# EasyEDA Pro project ProPrj_SRC_Robot2025_V1.0_2026-09-06.epro, schematic Schematic-CTRL

## Sheets
1 P1: Board Name: Ctrl_Board; Create Date: 2025-07-09; Page Name: P1; Project Name: SRC_Robot2025_V1.0; Schematic Name: Schematic-CTRL; Update Date: 2025-08-07; Company: 嘉立创EDA; Page Size: A4; Version: V1.0
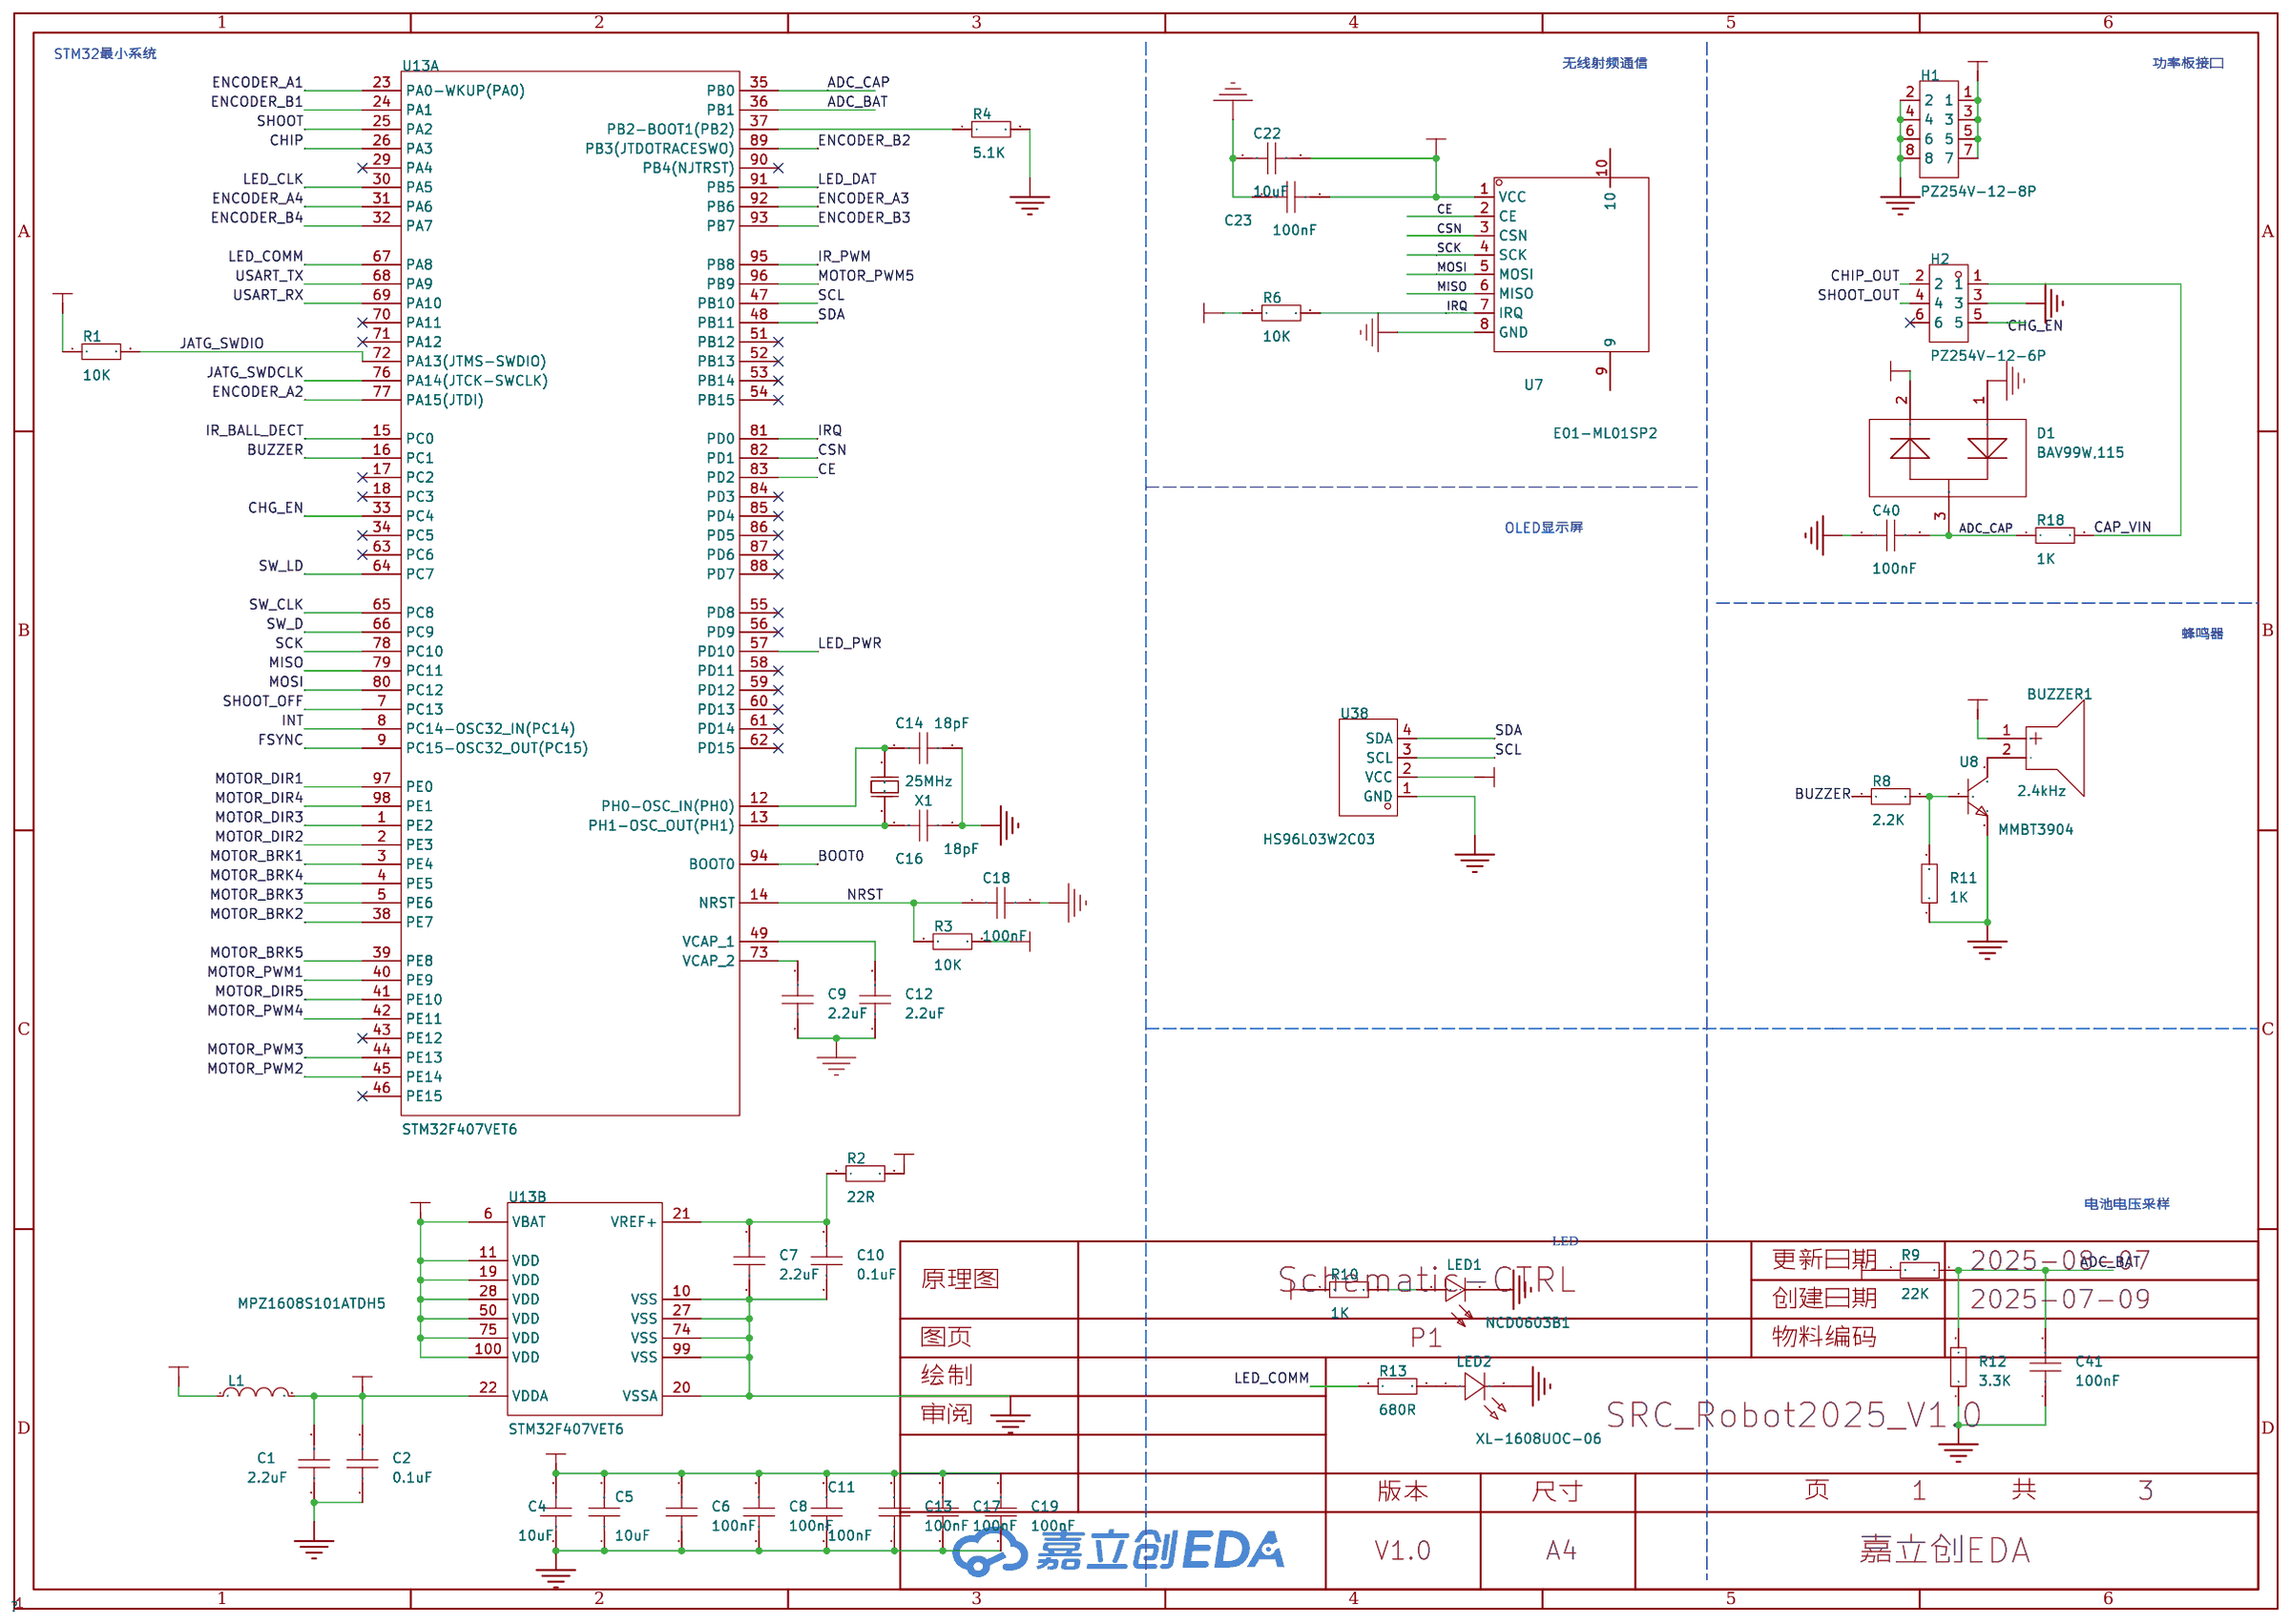
[diagram p0: P1]
2 P2: Page Name: P2
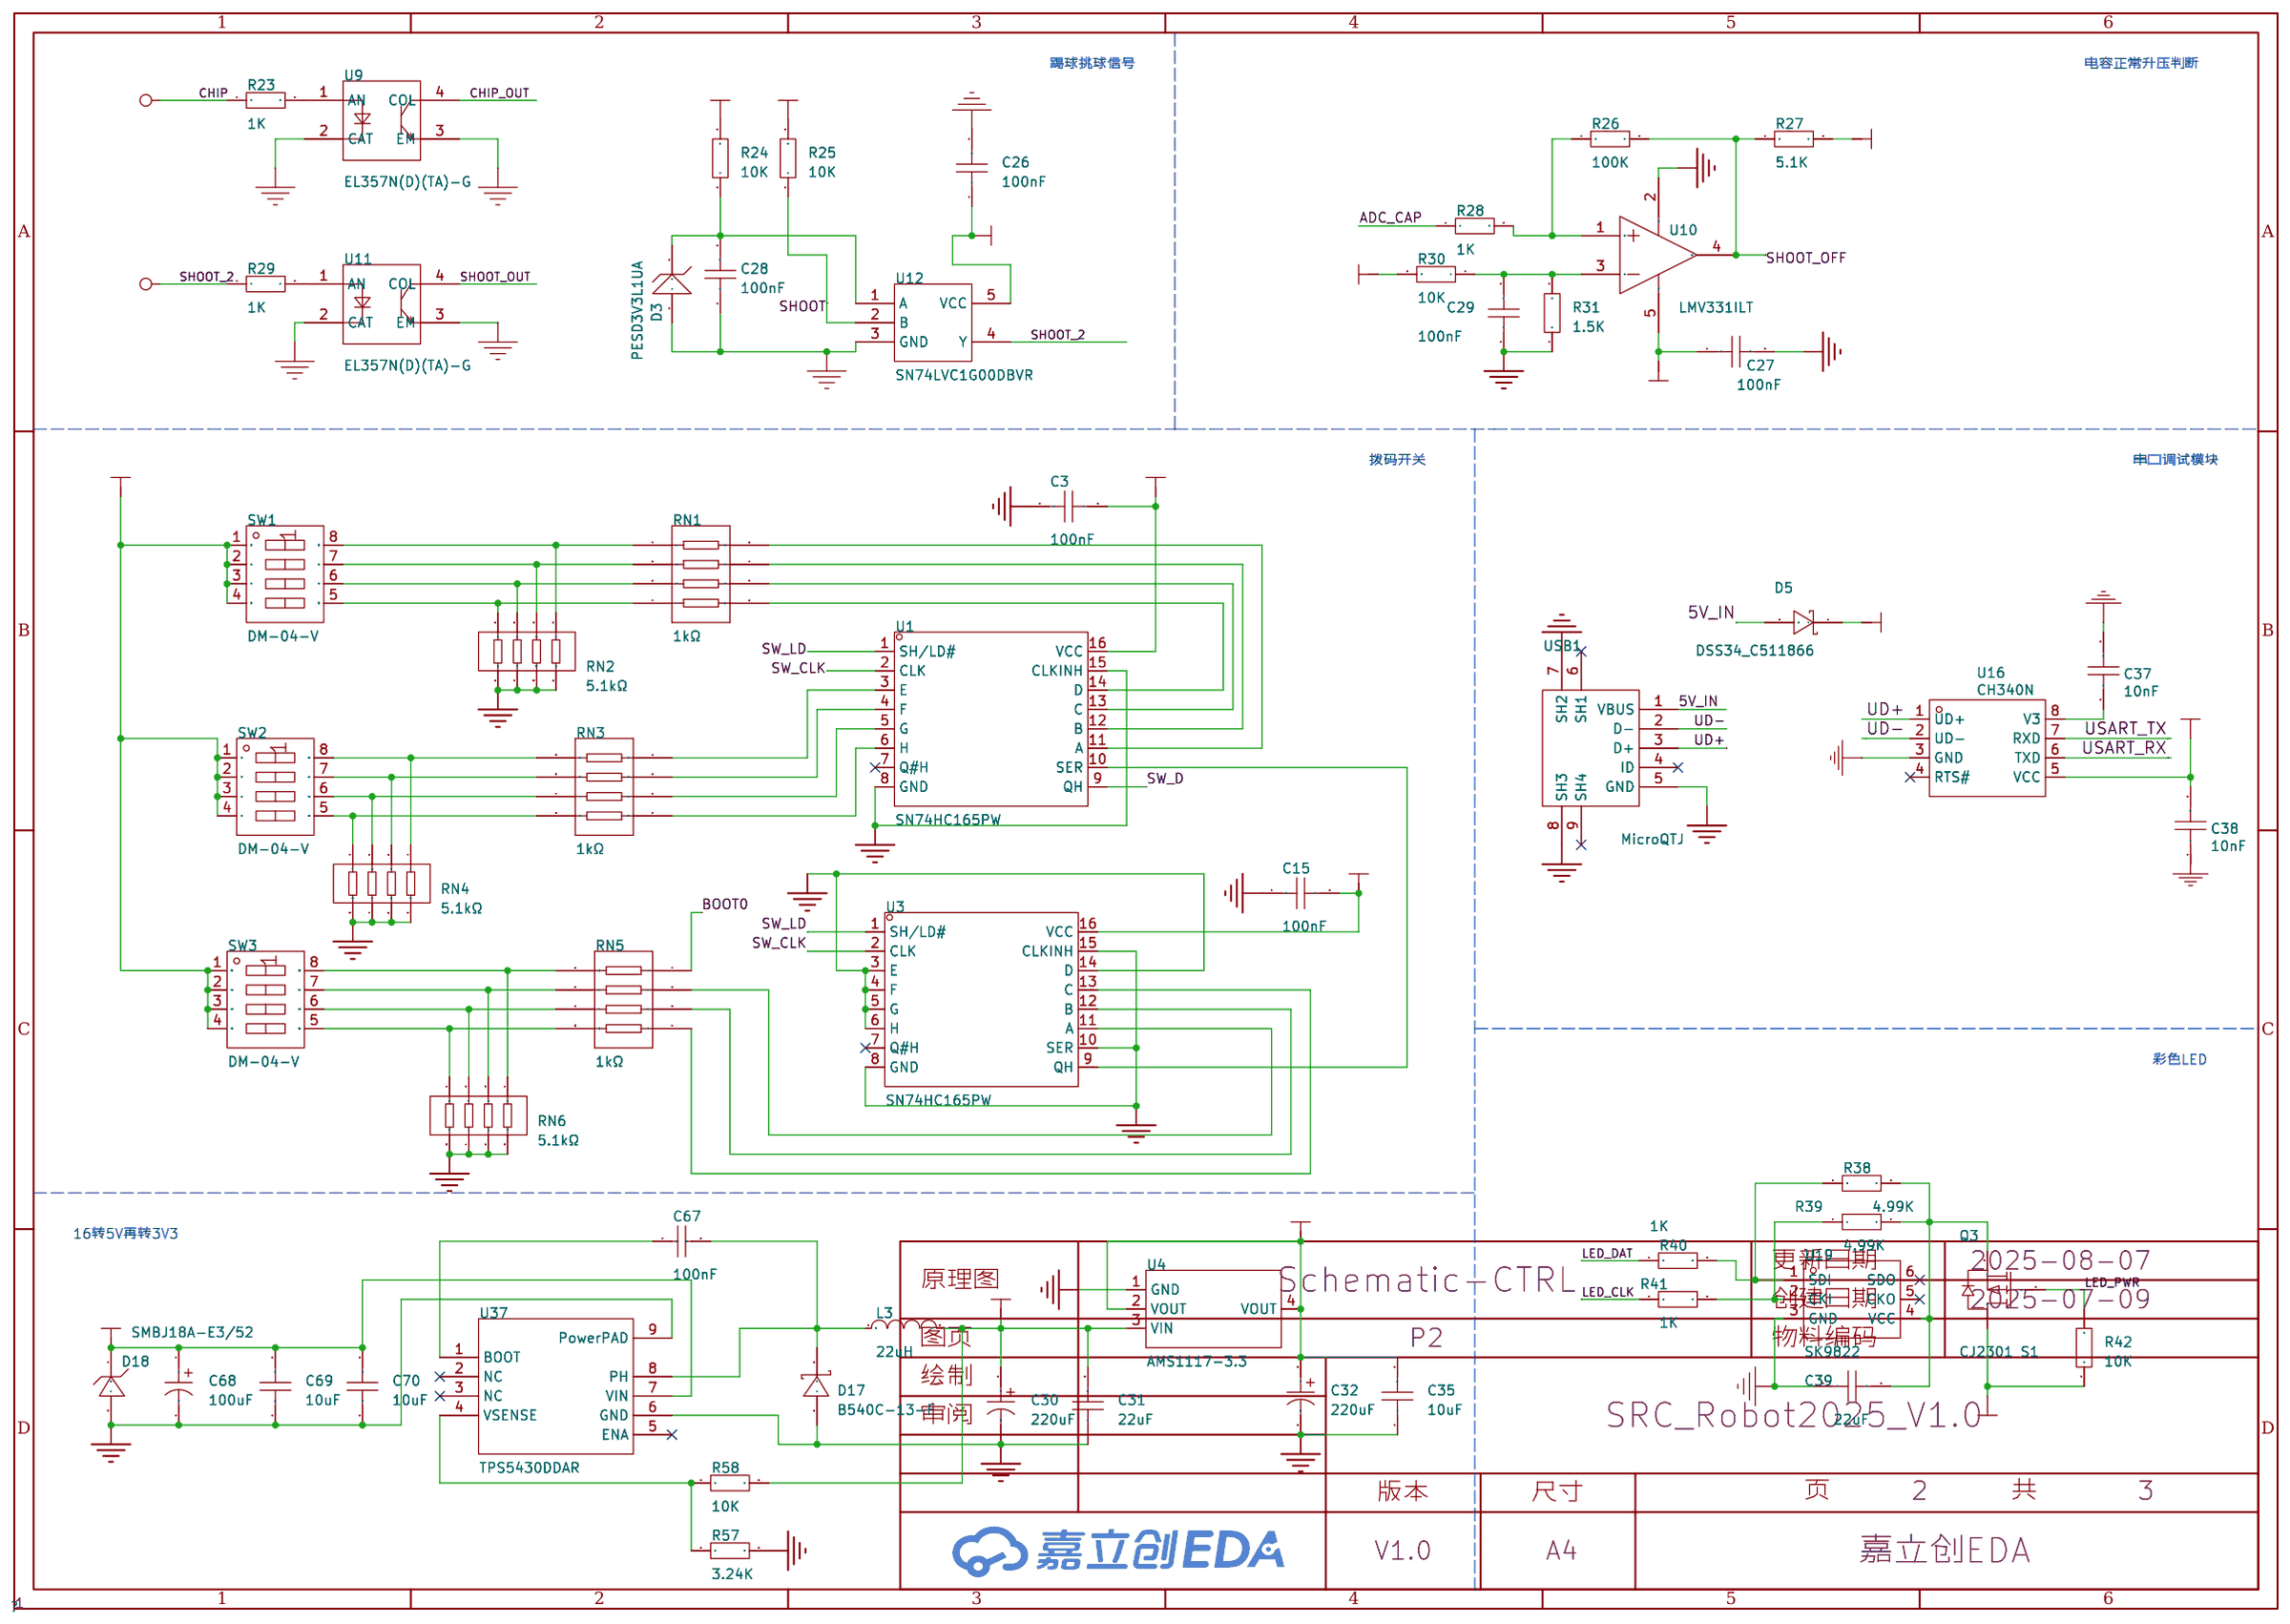
[diagram p1: P2]
3 P3: Page Name: P3; Update Date: 2026-03-02
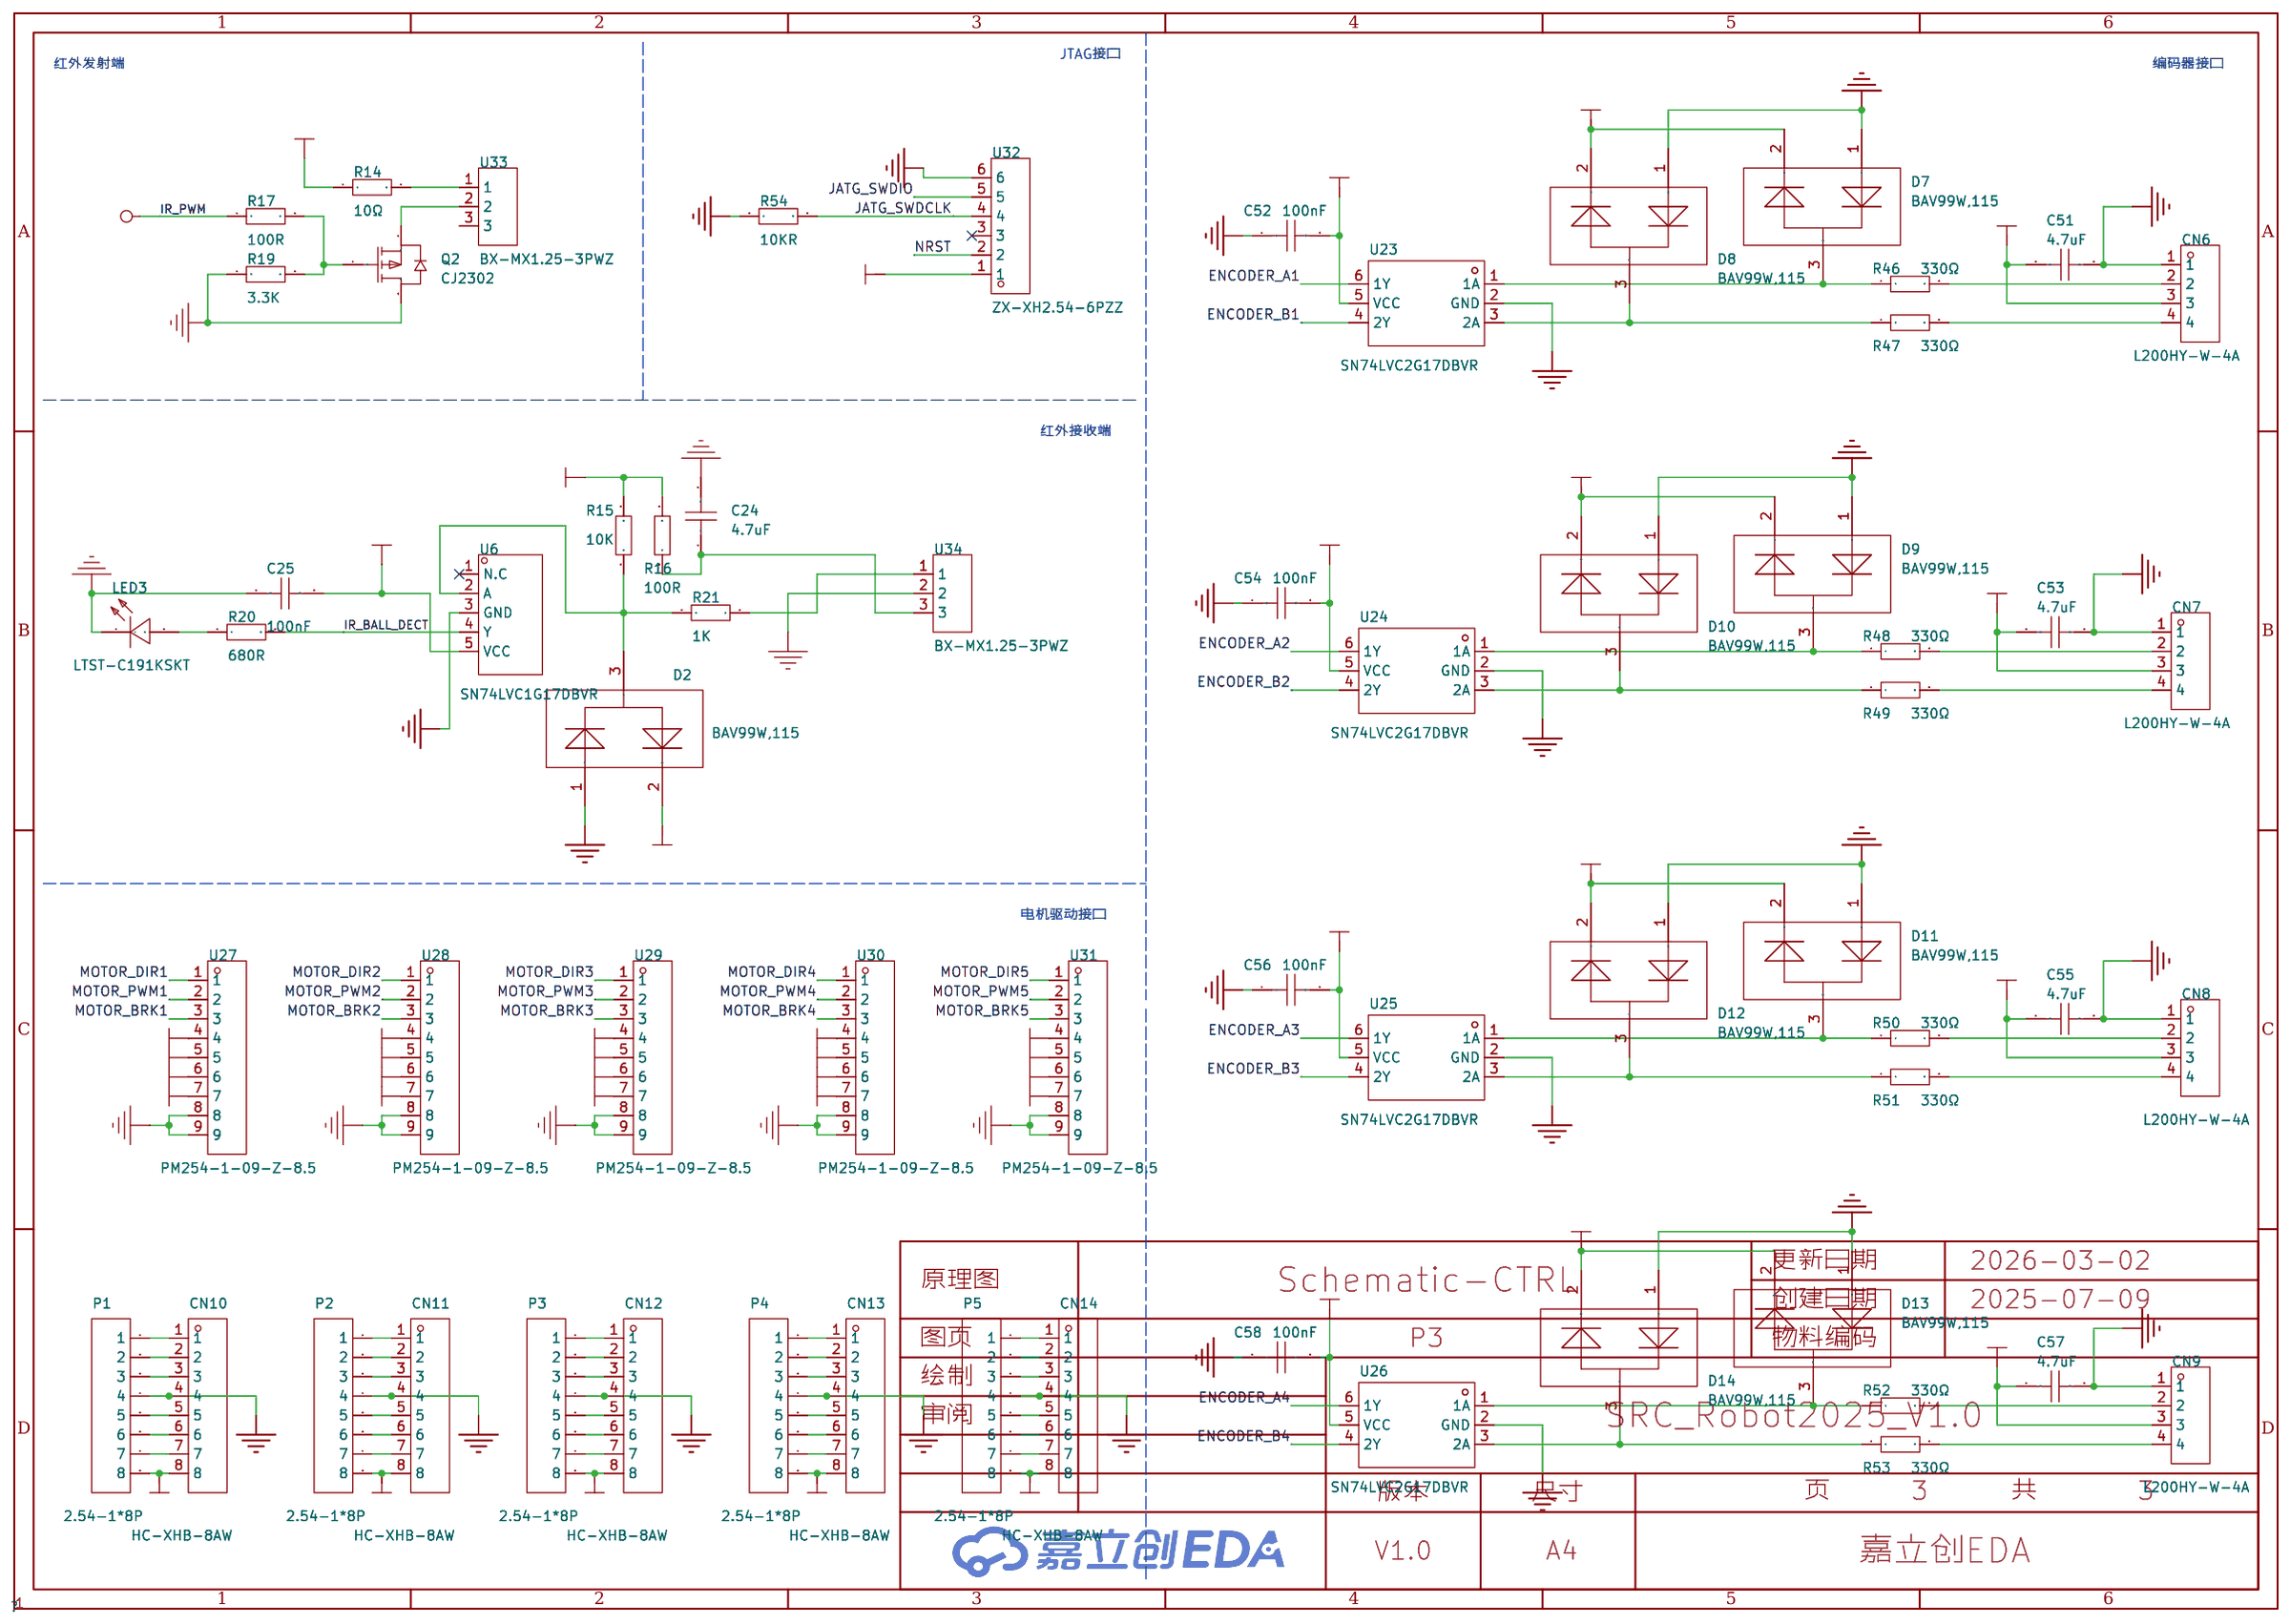
[diagram p2: P3]

## Parts
sheet P1
BUZZER1  2.4kHz  [BUZ-TH_BD12.0-P7.60-D0.6-FD]
C1  2.2uF  [C0603]
C2  0.1uF  [C0603]
C4  10uF  [C0603]
C5  10uF  [C0603]
C6  100nF  [C0603]
C7  2.2uF  [C0603]
C8  100nF  [C0603]
C9  2.2uF  [C0603]
C10  0.1uF  [C0603]
C11  100nF  [C0603]
C12  2.2uF  [C0603]
C13  100nF  [C0603]
C14  18pF  [C0603]
C16  18pF  [C0603]
C17  100nF  [C0603]
C18  100nF  [C0603]
C19  100nF  [C0603]
C22  10uF  [C0603]
C23  100nF  [C0603]
C40  100nF  [C0603]
C41  100nF  [C0603]
D1  BAV99W,115  [SOT-323_L2.0-W1.3-P1.30-LS2.1-BR]
H1  PZ254V-12-8P  [HDR-TH_8P-P2.54-V-M-R2-C4-S2.54]
H2  PZ254V-12-6P  [HDR-TH_6P-P2.54-V-M-R2-C3-S2.54]
L1  MPZ1608S101ATDH5  [L0603]
LED1  NCD0603B1  [LED0603-RD]
LED2  XL-1608UOC-06  [LED0603-R-RD_ORANGE]
R1  10K  [R0603]
R2  22R  [R0603]
R3  10K  [R0603]
R4  5.1K  [R0603]
R6  10K  [R0603]
R8  2.2K  [R0603]
R9  22K  [R0603]
R10  1K  [R0603]
R11  1K  [R0603]
R12  3.3K  [R0603]
R13  680R  [R0603]
R18  1K  [R0603]
U7  E01-ML01SP2  [WIRELM-SMD_E01-ML01SP2]
U8  MMBT3904  [SOT-23-3_L2.9-W1.3-P1.90-LS2.4-BR]
U13  STM32F407VET6  [LQFP-100_L14.0-W14.0-P0.50-LS16.0-BL]  (sections 1,2)
U38  HS96L03W2C03  [OLED-TH_L27.8-W27.2-P2.54_C9900033791]
X1  25MHz  [OSC-SMD_2P-L5.0-W3.2]
sheet P2
C3  100nF  [C0603]
C15  100nF  [C0603]
C26  100nF  [C0603]
C27  100nF  [C0603]
C28  100nF  [C0603]
C29  100nF  [C0603]
C30  220uF  [CAP-SMD_BD6.3-L6.6-W6.6-FD]
C31  22uF  [C0603]
C32  220uF  [CAP-SMD_BD6.3-L6.6-W6.6-FD]
C35  10uF  [C0603]
C37  10nF  [C0603]
C38  10nF  [C0603]
C39  22uF  [C0603]
C67  100nF  [C0402]
C68  100uF  [CAP-SMD_BD6.3-L6.6-W6.6-LS7.2-FD]
C69  10uF  [C0603]
C70  10uF  [C0603]
D3  PESD3V3L1UA  [SOD-323_L1.6-W1.3-LS2.6-RD]
D5  DSS34_C511866  [SOD-123FL_L2.7-W1.8-LS3.8-RD]
D17  B540C-13-F  [SMC_L7.1-W6.2-LS8.1-RD]
D18  SMBJ18A-E3/52  [SMB_L4.6-W3.6-LS5.4-RD]
L3  22uH  [IND-SMD_L12.5-W12.5_SLF12555T]
Q3  CJ2301 S1  [SOT-23-3_L3.0-W1.7-P0.95-LS2.9-BR]
R23  1K  [R0603]
R24  10K  [R0603]
R25  10K  [R0603]
R26  100K  [R0603]
R27  5.1K  [R0603]
R28  1K  [R0603]
R29  1K  [R0603]
R30  10K  [R0603]
R31  1.5K  [R0603]
R38  4.99K  [R0603]
R39  4.99K  [R0603]
R40  1K  [R0603]
R41  1K  [R0603]
R42  10K  [R0603]
R57  3.24K  [R0603]
R58  10K  [R0603]
RN1  1kΩ  [RES-ARRAY-SMD_0603-8P-L3.2-W1.6-BL]
RN2  5.1kΩ  [RES-ARRAY-SMD_0603-8P-L3.2-W1.6-BL]
RN3  1kΩ  [RES-ARRAY-SMD_0603-8P-L3.2-W1.6-BL]
RN4  5.1kΩ  [RES-ARRAY-SMD_0603-8P-L3.2-W1.6-BL]
RN5  1kΩ  [RES-ARRAY-SMD_0603-8P-L3.2-W1.6-BL]
RN6  5.1kΩ  [RES-ARRAY-SMD_0603-8P-L3.2-W1.6-BL]
SW1  DM-04-V  [SW-SMD_8P-L11.1-W6.2-P2.54-LS9.8]
SW2  DM-04-V  [SW-SMD_8P-L11.1-W6.2-P2.54-LS9.8]
SW3  DM-04-V  [SW-SMD_8P-L11.1-W6.2-P2.54-LS9.8]
U1  SN74HC165PW  [TSSOP-16_L5.0-W4.4-P0.65-LS6.4-BL]
U3  SN74HC165PW  [TSSOP-16_L5.0-W4.4-P0.65-LS6.4-BL]
U4  AMS1117-3.3  [SOT-223-3_L6.5-W3.4-P2.30-LS7.0-BR]
U9  EL357N(D)(TA)-G  [SOP-4_L3.9-W4.4-P2.54-LS7.0-TL]
U10  LMV331ILT  [SOT-23-5_L3.0-W1.6-P0.95-LS2.8-BR]
U11  EL357N(D)(TA)-G  [SOP-4_L3.9-W4.4-P2.54-LS7.0-TL]
U12  SN74LVC1G00DBVR  [SOT-23-5_L3.0-W1.7-P0.95-LS2.8-BR]
U16  CH340N  [SOP-8_L5.0-W4.0-P1.27-LS6.0-BL]
U19  SK9822  [SMD_6P-L5.0-W5.0-TL]
U37  TPS5430DDAR  [ESOP-8_L4.9-W3.9-P1.27-LS6.0-TL-EP]
USB1  MicroQTJ  [MICRO-USB-SMD_MICROQTJ]
sheet P3
C24  4.7uF  [C0603]
C25  100nF  [C0603]
C51  4.7uF  [C0603]
C52  100nF  [C0603]
C53  4.7uF  [C0603]
C54  100nF  [C0603]
C55  4.7uF  [C0603]
C56  100nF  [C0603]
C57  4.7uF  [C0603]
C58  100nF  [C0603]
CN6  L200HY-W-4A  [CONN-TH_L200HY-W-4A]
CN7  L200HY-W-4A  [CONN-TH_L200HY-W-4A]
CN8  L200HY-W-4A  [CONN-TH_L200HY-W-4A]
CN9  L200HY-W-4A  [CONN-TH_L200HY-W-4A]
CN10  HC-XHB-8AW  [CONN-TH_HC-XHB-8AW]
CN11  HC-XHB-8AW  [CONN-TH_HC-XHB-8AW]
CN12  HC-XHB-8AW  [CONN-TH_HC-XHB-8AW]
CN13  HC-XHB-8AW  [CONN-TH_HC-XHB-8AW]
CN14  HC-XHB-8AW  [CONN-TH_HC-XHB-8AW]
D2  BAV99W,115  [SOT-323_L2.0-W1.3-P1.30-LS2.1-BR]
D7  BAV99W,115  [SOT-323_L2.0-W1.3-P1.30-LS2.1-BR]
D8  BAV99W,115  [SOT-323_L2.0-W1.3-P1.30-LS2.1-BR]
D9  BAV99W,115  [SOT-323_L2.0-W1.3-P1.30-LS2.1-BR]
D10  BAV99W,115  [SOT-323_L2.0-W1.3-P1.30-LS2.1-BR]
D11  BAV99W,115  [SOT-323_L2.0-W1.3-P1.30-LS2.1-BR]
D12  BAV99W,115  [SOT-323_L2.0-W1.3-P1.30-LS2.1-BR]
D13  BAV99W,115  [SOT-323_L2.0-W1.3-P1.30-LS2.1-BR]
D14  BAV99W,115  [SOT-323_L2.0-W1.3-P1.30-LS2.1-BR]
LED3  LTST-C191KSKT  [LED0603-RD-YELLOW]
P1  2.54-1*8P  [HDR-TH_8P-P2.54-V-F-1]
P2  2.54-1*8P  [HDR-TH_8P-P2.54-V-F-1]
P3  2.54-1*8P  [HDR-TH_8P-P2.54-V-F-1]
P4  2.54-1*8P  [HDR-TH_8P-P2.54-V-F-1]
P5  2.54-1*8P  [HDR-TH_8P-P2.54-V-F-1]
Q2  CJ2302  [SOT-23-3_L2.9-W1.3-P1.90-LS2.4-BR]
R14  10Ω  [R0603]
R15  10K  [R0603]
R16  100R  [R0603]
R17  100R  [R0603]
R19  3.3K  [R0603]
R20  680R  [R0603]
R21  1K  [R0603]
R46  330Ω  [R0603]
R47  330Ω  [R0603]
R48  330Ω  [R0603]
R49  330Ω  [R0603]
R50  330Ω  [R0603]
R51  330Ω  [R0603]
R52  330Ω  [R0603]
R53  330Ω  [R0603]
R54  10KR  [R0603]
U6  SN74LVC1G17DBVR  [SOT-23-5_L3.0-W1.7-P0.95-LS2.8-BR]
U23  SN74LVC2G17DBVR  [SOT-23-6_L2.9-W1.6-P0.95-LS2.8-BL]
U24  SN74LVC2G17DBVR  [SOT-23-6_L2.9-W1.6-P0.95-LS2.8-BL]
U25  SN74LVC2G17DBVR  [SOT-23-6_L2.9-W1.6-P0.95-LS2.8-BL]
U26  SN74LVC2G17DBVR  [SOT-23-6_L2.9-W1.6-P0.95-LS2.8-BL]
U27  PM254-1-09-Z-8.5  [HDR-TH_9P-P2.54-V-F]
U28  PM254-1-09-Z-8.5  [HDR-TH_9P-P2.54-V-F]
U29  PM254-1-09-Z-8.5  [HDR-TH_9P-P2.54-V-F]
U30  PM254-1-09-Z-8.5  [HDR-TH_9P-P2.54-V-F]
U31  PM254-1-09-Z-8.5  [HDR-TH_9P-P2.54-V-F]
U32  ZX-XH2.54-6PZZ  [CONN-TH_6P-P2.50_ZX-XH2.54-6PZZ]
U33  BX-MX1.25-3PWZ  [CONN-TH_3P-P1.25_BX-MX1.25-3PWZ]
U34  BX-MX1.25-3PWZ  [CONN-TH_3P-P1.25_BX-MX1.25-3PWZ]

## Library data of the parts
BUZZER1 = YS-MBZ12095DYB05: 驱动方式:有源(内含驱动线路);构造类型:电磁式;频率:2.4kHz;声压(SPL):85dB@10cm;; LCSC Part Name: 电磁式有源一体蜂鸣器5V; Supplier Part: C409831; Manufacturer: Fengming(锋鸣电子); Supplier Footprint: 插件,D=12mm; JLCPCB Part Class: 扩展库; Datasheet: https://atta.szlcsc.com/upload/public/pdf/source/20191217/C409831_C860C9DA8F2743B4A1AB718C47E1D43F.pdf; Supplier: LCSC; Oscillator Circuit: 有源(内含驱动线路); Technology Type: 电磁式; Operating Voltage: 3V~7V; Current Consumption: 30mA; Sound Pressure Level (SPL): 85dB@10cm; Diameter (φD): 12mm; Height: 9.5mm; Operating Temperature: -20℃~+70℃
C1-C19 C22-C29 C31 C35 C39-C41 = CAP_0603: Supplier Footprint: 0603
D1 D2 D7-D14 = BAV99W,115: 二极管配置:1对串联式;正向压降(Vf):1.25V@150mA;直流反向耐压(Vr):100V;平均整流电流(Io):150mA;功率:200mW;反向恢复时间(trr):4ns;; LCSC Part Name: 电压:100V 电流:150mA; Supplier Part: C8662; Manufacturer: Nexperia(安世); Supplier Footprint: SOT-323-3; JLCPCB Part Class: Extended Part; Datasheet: https://atta.szlcsc.com/upload/public/pdf/source/20151007/1457707429518.pdf; Supplier: LCSC; Diode Configuration: 1对串联式; Forward Voltage (Vf@If): 1.25V@150mA; Reverse Voltage (Vr): 100V; Average Rectified Current (Io): 150mA; Power Dissipation: 200mW; Reverse Leakage Current: 500nA@80V; Reverse Recovery Time (trr): 4ns
H1 = PZ254V-12-8P: 插针结构:2x4P;间距:2.54mm;行距:2.54mm;圆针/方针:方针;安装方式:直插;排数:双排;总PIN位数:8P;额定电流:-;额定电压:-;配合针长度:6mm;塑高:2.5mm;端接针长度:3mm;触头材质:黄铜;触头镀层:-;工作温度:-40℃~+105℃;颜色:黑色;; LCSC Part Name: 2x4P 间距:2.54mm 方针 直插; Supplier Part: C492421; Manufacturer: XFCN(兴飞); Supplier Footprint: 插件,P=2.54mm; JLCPCB Part Class: 扩展库; Datasheet: https://atta.szlcsc.com/upload/public/pdf/source/20200309/C492421_DC8A206AF99CD7755BD4A5B0BC48200B.pdf; Supplier: LCSC; Pin Structure: 2x4P; Pitch: 2.54mm; Row Spacing: 2.54mm; Circluar Pins/Square Pins: 方针; Mounting Type: 直插; Number of Rows: 双排; Number of Pins: 8P; Length of Mating Pin: 6mm; Insulation Height: 2.5mm; Length of End Connection Pin: 3mm; Contact Material: 黄铜; Operating Temperature: -40℃~+105℃; Color: 黑色
H2 = PZ254V-12-6P: 插针结构:2x3P;间距:2.54mm;行距:2.54mm;圆针/方针:方针;安装类型:直插;排数:双排;总PIN位数:6P;额定电流:-;额定电压:-;配合针长度:6mm;塑高:2.5mm;端接针长度:3mm;触头材质:黄铜;触头镀层:-;工作温度范围:-40℃~+105℃;颜色:黑色;; LCSC Part Name: 间距:2.54mm 2x3P 直插 方针; Supplier Part: C492420; Manufacturer: XFCN(兴飞); Supplier Footprint: 插件,P=2.54mm; JLCPCB Part Class: 扩展库; Datasheet: https://atta.szlcsc.com/upload/public/pdf/source/20200309/C492420_BAECB307B001054C09D200388220EAE6.pdf; Supplier: LCSC; Pin Structure: 2x3P; Pitch: 2.54mm; Row Spacing: 2.54mm; Circluar Pins/Square Pins: 方针; Mounting Type: 直插; Number of Rows: 双排; Number of Pins: 6P; Length of Mating Pin: 6mm; Insulation Height: 2.5mm; Length of End Connection Pin: 3mm; Contact Material: 黄铜; Operating Temperature Range: -40℃~+105℃; Color: 黑色
L1 = MPZ1608S101ATDH5: 标称阻抗@测试频率:100Ω@100MHz;直流电阻(RDC):30mΩ;; LCSC Part Name: 单路 0603磁珠 阻抗100Ω@100MHz; Supplier Part: C307769; Manufacturer: TDK; Supplier Footprint: 0603; JLCPCB Part Class: 扩展库; Datasheet: https://atta.szlcsc.com/upload/public/pdf/source/20221212/68556A34E6BD59B4E0BDA1FC9D00C9BC.pdf; Supplier: LCSC; Impedance @ Frequency: 100Ω@100MHz; DC Resistance: 30mΩ; Current Rating: 3A; Circuits: 1
LED1 = NCD0603B1: 发光颜色:蓝色;正向电压(VF):2.6V~3.6V;功率:72mW;正向电流:10mA;主波长:463nm~475nm;透镜颜色:无色透明透镜;发光强度:80mcd~220mcd;发光角度:130°;工作温度:-30℃~+85℃;; Supplier Part: C84266; Manufacturer: 国星光电; Supplier Footprint: 0603; JLCPCB Part Class: 扩展库; Datasheet: https://atta.szlcsc.com/upload/public/pdf/source/20200820/C84266_6A3CDBEFA72C6CAD68EDA53474ADAE6C.pdf; Supplier: LCSC; Emitted Color: 蓝色; Forward Voltage (VF): 2.6V~3.6V; Power Dissipation: 72mW; Forward Current: 10mA; Dominant Wavelength: 463nm~475nm; Lens Color: 无色透明透镜; Luminous Intensity: 80mcd~220mcd; Viewing Angle: 130°; Operating Temperature: -30℃~+85℃
LED2 = XL-1608UOC-06: 发光颜色:橙色;功率:55mW;正向电流:25mA;主波长:601nm~603nm;透镜颜色:无色透明透镜;色温:-;发光角度:120°;载带方式:正贴;工作温度:-30℃~+85℃;; Supplier Part: C965800; Manufacturer: XINGLIGHT(成兴光); Supplier Footprint: 0603; JLCPCB Part Class: 扩展库; Datasheet: https://atta.szlcsc.com/upload/public/pdf/source/20221102/AE009D8ACFA5525E08B22F015CB50531.pdf; Supplier: LCSC; Emitted Color: 橙色; Power Dissipation: 55mW; Forward Current: 25mA; Dominant Wavelength: 601nm~603nm; Peak Wavelength: 605nm; Lens Color: 无色透明透镜; Viewing Angle: 120°; Mounting Sytle: 正贴; Operating Temperature: -30℃~+85℃
R1-R4 R6 R8-R13 R15-R21 R23-R31 R38-R42 R54 R57 R58 = Res_0603: Supplier Footprint: 0603
U7 = E01-ML01SP2: nRF24L01+PA+LNA 远距离/双天线/无线模块/数传/2.4G射频/工业级; Supplier Part: C108544; Manufacturer: EBYTE(亿佰特); Supplier Footprint: SMD; JLCPCB Part Class: 扩展库; Datasheet: https://atta.szlcsc.com/upload/public/pdf/source/20170428/1493376750150.pdf; Supplier: LCSC
U8 = MMBT3904_C7420353: 晶体管类型:NPN;集电极电流(Ic):200mA;集射极击穿电压(Vceo):40V;功率(Pd):200mW;直流电流增益(hFE@Ic,Vce):100@10mA,1.0V;; LCSC Part Name: 耐压:40V 电流:200mA NPN; Supplier Part: C7420353; Manufacturer: 宏迦橙; Supplier Footprint: SOT-23; JLCPCB Part Class: 扩展库; Datasheet: https://atta.szlcsc.com/upload/public/pdf/source/20231222/9A010B27D82CC750314EB13106235FB7.pdf; Supplier: LCSC; Transistor Type: NPN; Collector Current (Ic): 200mA; Collector-Emitter Breakdown Voltage (Vceo): 40V; Power Dissipation (Pd): 200mW; DC Current Gain (hFE@Ic,Vce): 100@10mA,1.0V; Transition Frequency (fT): 300MHz; Collector Cut-Off Current (Icbo): 100nA; Collector-Emitter Saturation Voltage (VCE(sat)@Ic,Ib): 300mV@50mA,5.0mA; Operating Temperature: -55℃~+150℃
U13 = STM32F407VET6: CPU内核:ARM-M4;程序存储容量:512KB;RAM总容量:192KB;GPIO端口数量:82;工作电压范围:1.8V~3.6V;CPU最大主频:168MHz;程序存储器类型:FLASH;; LCSC Part Name: 带DSP和FPU的高性能基础系列ARM Cortex-M4 MCU，具有512 KB Flash、168 MHz CPU、ART加速器、以太网和FSMC; Supplier Part: C28730; Manufacturer: ST(意法半导体); Supplier Footprint: LQFP-100(14x14); JLCPCB Part Class: 扩展库; Datasheet: https://atta.szlcsc.com/upload/public/pdf/source/20140801/1457707197138.pdf; Supplier: LCSC; CPU Core: ARM-M4; Program Storage Size: 512KB; RAM Size: 192KB; GPIO Ports Number: 82; Operating Voltage Range: 1.8V~3.6V; CPU Maximum Speed: 168MHz; Program Memory Type: FLASH; Operating Temperature Range: -40℃~+85℃; ADC (Bit): 12bit; DAC (Bit): 12bit; Universal Serial Bus: 有; Peripheral/Function: DMA；LCD/LED驱动；PWM; Watchdog: 有; Infrared Data Association: 有; Low-Voltage Detect: 有; LCD Module: 有; Direct Memory Access: 有; Internal Oscillator: 有
U38 = HS96L03W2C03: 主控芯片:SSD1315;接口类型:I2C;尺寸(inch):0.96;像素分辨率:128x64;; LCSC Part Name: 0.96寸OLED显示屏窄白光IIC; Supplier Part: C5248080; Manufacturer: HS(汉昇); JLCPCB Part Class: 扩展库; Datasheet: https://atta.szlcsc.com/upload/public/pdf/source/20230627/763D01F79A90007632F098068C7C8AD9.pdf; Supplier: LCSC; Main Control Chip: SSD1315; Interface Type: I2C; Size: 0.96; Pixel Resolution: 128x64; Operating Temperature: -40℃~+70℃
X1 = XSHEELNANF-25MHZ: 晶振类型:贴片晶振;频率:25MHz;常温频差:±30ppm;外接负载电容:20pF;频率稳定度(全温):±30ppm;; LCSC Part Name: 25MHz ±30ppm 20pF; Supplier Part: C242220; Manufacturer: TAITIEN(泰艺电子); Supplier Footprint: SMD5032; JLCPCB Part Class: 扩展库; Datasheet: https://atta.szlcsc.com/upload/public/pdf/source/20180704/C242220_3EEAD479794F46F9C3E96148C61AC2EE.pdf; Supplier: LCSC; Crystal Type: 贴片晶振; Normal temperature Frequency Tolerance: ±30ppm; External load capacitor: 20pF; Frequency Stability(Full temperature range): ±30ppm; Operating Temperature: -40℃~+85℃
C30 C32 = RVT220UF10V67RV0037: 容值:220uF;精度:±20%;额定电压:10V;纹波电流:69mA@120Hz;等效串联电阻(ESR):-;; LCSC Part Name: 220uF ±20% 10V; Supplier Part: C2833309; Manufacturer: KNSCHA(科尼盛); Supplier Footprint: SMD,D6.3xL5.4mm; JLCPCB Part Class: 扩展库; Datasheet: https://atta.szlcsc.com/upload/public/pdf/source/20210521/C2833309_008BCE4BC4FC60DA08096FEE6338ABBD.pdf; Supplier: LCSC; Tolerance: ±20%; Voltage Rating: 10V; Ripple Current: 69mA@120Hz; Diameter: 6.3mm; Height - Seated (Max): 5.4mm; Lifetime: 2000hrs@105℃; Operating Temperature: -55℃~+105℃
C37 C38 = 10nF
C67 = CC0402KRX5R9BB104: 容值:100nF;精度:±10%;额定电压:50V;材质(温度系数):X5R;; LCSC Part Name: 100nF ±10% 50V; Supplier Part: C105882; Manufacturer: YAGEO(国巨); Supplier Footprint: 0402; JLCPCB Part Class: 扩展库; Datasheet: https://atta.szlcsc.com/upload/public/pdf/source/20181008/C309506_01C87B2C86DBD1236B532041A9B60642.pdf; Supplier: LCSC; Tolerance: ±10%; Voltage Rated: 50V; Temperature Coefficient: X5R
C68 = RVT1V101M0607 100UF 35V: 容值:100uF;精度:±20%;额定电压:35V;纹波电流:87mA@120Hz;等效串联电阻(ESR):-;; LCSC Part Name: 100uF ±20% 35V; Supplier Part: C970686; Manufacturer: DMBJ(振宝佳); Supplier Footprint: SMD,D6.3xL7.7mm; JLCPCB Part Class: 扩展库; Datasheet: https://atta.szlcsc.com/upload/public/pdf/source/20201217/C970594_282EC4D70669AEE33806F6C24A5FAA0B.pdf; Supplier: LCSC; Tolerance: ±20%; Voltage Rating: 35V; Ripple Current: 87mA@120Hz; Diameter: 6.3mm; Height - Seated (Max): 7.7mm; Lifetime: 2800hrs@105℃; Operating Temperature: -55℃~+105℃
C69 C70 = GRM188R6YA106MA73D: 容值:10uF;精度:±20%;额定电压:35V;材质(温度系数):X5R;; LCSC Part Name: 10uF ±20% 35V; Supplier Part: C194427; Manufacturer: muRata(村田); Supplier Footprint: 0603; JLCPCB Part Class: 扩展库; Datasheet: https://atta.szlcsc.com/upload/public/pdf/source/20210128/C194427_FCA3640823207DDB58700A82F1A19B5F.pdf; Supplier: LCSC; Tolerance: ±20%; Voltage Rated: 35V; Temperature Coefficient: X5R
D3 = PESD3V3L1UA: Library Name: Schlib1
D5 = DSS34_C511866: Supplier: LCSC; Supplier Part: C511866; Manufacturer: BORN(伯恩半导体); Manufacturer Part: DSS34; JLCPCB Part Class: Extended Part
D17 = B540C-13-F: 正向压降(Vf):550mV@5A;直流反向耐压(Vr):40V;平均整流电流(Io):5A;; LCSC Part Name: 电压:40V 电流:5A; Supplier Part: C72264; Manufacturer: DIODES(美台); Supplier Footprint: SMC(DO-214AB); JLCPCB Part Class: 扩展库; Datasheet: https://atta.szlcsc.com/upload/public/pdf/source/20171023/C134461_15087453602301052556.pdf; Supplier: LCSC; Forward Voltage (Vf@If): 550mV@5A; Reverse Voltage (Vr): 40V; Average Rectified Current (Io): 5A; Reverse Leakage Current (Ir): 500uA@40V
D18 = SMBJ18A-E3/52: 反向截止电压(Vrwm):18V;最大钳位电压:29.2V;峰值脉冲电流(Ipp)@10/1000us:20.5A;峰值脉冲功率(Ppp)@10/1000us:600W;击穿电压:20V;; Supplier Part: C435935; Manufacturer: VISHAY(威世); Supplier Footprint: SMB; JLCPCB Part Class: Extended Part; Datasheet: https://atta.szlcsc.com/upload/public/pdf/source/20191009/C435939_EC13D582B73C228060B5D2BC7D2C8C7F.pdf; Supplier: LCSC; Reverse Stand-Off Voltage (Vrwm): 18V; Maximum Clamping Voltage: 29.2V; Peak Pulse Current (Ipp)@10/1000us: 20.5A; Peak Pulse Power Dissipation (Ppp)@10/1000us: 600W; Breakdown Voltage: 20V; Type: TVS
L3 = YSLF1275-220M: 电感值:22uH;精度:±20%;额定电流:4A;类型:磁胶屏蔽电感;; LCSC Part Name: 22uH ±20%; Supplier Part: C693896; Manufacturer: YJYCOIN(益嘉源); Supplier Footprint: SMD,12.5x12.5mm; JLCPCB Part Class: 扩展库; Datasheet: https://atta.szlcsc.com/upload/public/pdf/source/20200629/C693893_82097FFA6D41E3DD06289E0102D7BD95.pdf; Supplier: LCSC; Tolerance: ±20%; Current Rating: 4A; DC Resistance(DCR): 32mΩ; Type: 磁胶屏蔽电感
Q3 = CJ2301 S1: 类型:1个P沟道;漏源电压(Vdss):20V;连续漏极电流(Id):2.3A;功率(Pd):350mW;导通电阻(RDS(on)@Vgs,Id):112mΩ@4.5V,2.8A;阈值电压(Vgs(th)@Id):1V@250uA;; LCSC Part Name: 1个P沟道 耐压:20V 电流:2.3A; Supplier Part: C8547; Manufacturer: CJ(江苏长电/长晶); Supplier Footprint: SOT-23; JLCPCB Part Class: 扩展库; Datasheet: https://atta.szlcsc.com/upload/public/pdf/source/20140815/1457707224119.pdf; Supplier: LCSC; Type: 1个P沟道; Drain Source Voltage (Vdss): 20V; Continuous Drain Current (Id): 2.3A; Power Dissipation (Pd): 350mW; Drain Source On Resistance (RDS(on)@Vgs,Id): 112mΩ@4.5V,2.8A; Gate Threshold Voltage (Vgs(th)@Id): 1V@250uA
RN1 RN3 RN5 = 4D03WGJ0102T5E: 电阻器数:4;阻值:1kΩ;精度:±5%;单个元件功率:62.5mW;温度系数:±200ppm/℃;; LCSC Part Name: 1kΩ ±5%; Supplier Part: C20197; Manufacturer: UNI-ROYAL(厚声); Supplier Footprint: 0603x4; JLCPCB Part Class: 基础库; Datasheet: https://atta.szlcsc.com/upload/public/pdf/source/20191224/C474318_2527498AE30E813171187CCD28401A71.pdf; Supplier: LCSC; Number of Resistors: 4; Tolerance: ±5%; Power(Watts): 62.5mW; Temperature Coefficient: ±200ppm/℃; Number of Pins: 8
RN2 RN4 RN6 = 4D03WGF5101T5E: 电阻器数:4;阻值:5.1kΩ;精度:±1%;单个元件功率:62.5mW;温度系数:±200ppm/℃;; LCSC Part Name: 5.1kΩ ±1% 0603x4; Supplier Part: C425200; Manufacturer: UNI-ROYAL(厚声); Supplier Footprint: 0603x4; JLCPCB Part Class: 扩展库; Datasheet: https://atta.szlcsc.com/upload/public/pdf/source/20191224/C474318_2527498AE30E813171187CCD28401A71.pdf; Supplier: LCSC; Number of Resistors: 4; Tolerance: ±1%; Power(Watts): 62.5mW; Temperature Coefficient: ±200ppm/℃; Number of Pins: 8
SW1-SW3 = DM-04-V: 平拨高杆; LCSC Part Name: 4位贴片拨码; Supplier Part: C501537; Manufacturer: 圜达; Supplier Footprint: SMD-8P,6.2x11.1mm; JLCPCB Part Class: 扩展库; Datasheet: https://atta.szlcsc.com/upload/public/pdf/source/20180517/C225004_4F2B383AD299DB6B1022D1902AAEA37B.pdf; Supplier: LCSC
U1 U3 = SN74HC165PW: 功能:并行或串行至串行;电源电压:2V~6V;每个元件位数:8;; LCSC Part Name: 补充型输出 8位并行或串行至串行移位寄存器; Supplier Part: C80093; Manufacturer: TI(德州仪器); Supplier Footprint: TSSOP-16; JLCPCB Part Class: 扩展库; Datasheet: https://www.ti.com/cn/lit/gpn/sn74hc165; Supplier: LCSC; Function: 并行或串行至串行; Supply Voltage: 2V~6V; Number of Bits per Element: 8; Output Type: 补充型; Series: 74HC; Operating Temperature: -40℃~+125℃
U4 = AMS1117-3.3_C6186: 输出类型:固定;工作电压:16V;输出电压:3.3V;输出电流:1A;电源纹波抑制比(PSRR):72dB@(120Hz);输出极性:正极;; LCSC Part Name: 输出3.3V 1A; Supplier Part: C6186; Manufacturer: AMS; Supplier Footprint: SOT-223; JLCPCB Part Class: 基础库; Datasheet: https://atta.szlcsc.com/upload/public/pdf/source/20180727/C6186_7A095716F0823C02F1997A905E26C086.pdf; Supplier: LCSC; Output Type: 固定; Voltage - Supply: 16V; Output Voltage: 3.3V; Output Current: 1A; Power Supply Rejection Ratio (PSRR): 72dB@(120Hz); Voltage Dropout: 1.1V@(800mA); standby current: 5mA; Features: 过流保护；过热保护; Operating Temperature: -40℃~+125℃; Output Configuration: 正极; Number of Outputs: 1
U9 U11 = EL357N(D)(TA)-G: 输入电压类型:DC;正向电压:1.2V;输出电流:50mA;隔离电压(rms):3.75kV;反向电压:6V;接收端电压:80V;输出通道数:1;集射极饱和电压(Vce(sat)@Ic,IF):100mV@1mA,20mA;; LCSC Part Name: DC输入 隔离电压(rms):3750V; Supplier Part: C142283; Manufacturer: EVERLIGHT(亿光); Supplier Footprint: SOP-4-2.54mm; JLCPCB Part Class: 扩展库; Datasheet: https://atta.szlcsc.com/upload/public/pdf/source/20190327/C359074_3096960C9AFB5A402BAA5709F4ADE18D.pdf; Supplier: LCSC; Input voltage type: DC; Output Type: 光电三极管; Forward Voltage: 1.2V; Output Current: 50mA; Isolation Voltage(rms): 3.75kV; Reverse Voltage: 6V; Receiving End Voltage: 80V; Number of Outputs: 1; Collector-Emitter Saturation Voltage (Vce(sat)@Ic,IF): 100mV@1mA,20mA; Rise time: 3us@2mA,100Ω; Fall time: 4us@2mA,100Ω; Operating Temperature: -55℃~+110℃
U10 = LMV331ILT_C7419966: Supplier Part: C7419966; Manufacturer: TECH PUBLIC(台舟); Supplier Footprint: SOT23-5; JLCPCB Part Class: 扩展库; Datasheet: https://atta.szlcsc.com/upload/public/pdf/source/20230605/B06A4050D6FF8BB18E88BF26782750EC.pdf; Supplier: LCSC
U12 = SN74LVC1G00DBVR: 逻辑类型:与非门;通道数:1;电源电压:1.65V~5.5V;静态电流(最大值):10uA;最大传播延迟:4.3ns@5V,50pF;; Supplier Part: C7826; Manufacturer: TI(德州仪器); Supplier Footprint: SOT-23-5; JLCPCB Part Class: 扩展库; Datasheet: https://www.ti.com/cn/lit/gpn/sn74lvc1g00; Supplier: LCSC; Logic Gate Type: 与非门; Number of Channels: 1; Supply Voltage: 1.65V~5.5V; Quiescent Current (Max): 10uA; Sink Current: 32mA; Source Current: 32mA; High Level Range (VIH): 1.7V~2V; Low Level Range (VIL): 700mV~800mV; Series: 74LVC系列; Propagation Delay Time: 4.3ns@5V,50pF; Operating Temperature: -40℃~+125℃
U16 = CH340N: Supplier: LCSC; Supplier Part: C506813; Manufacturer: WCH(南京沁恒); JLCPCB Part Class: Extended Part
U19 = SK9822: 类型:-;输入电压:-;开关频率:-;通道数:2;输出电压:-;调光:PWM;拓扑结构:-;; LCSC Part Name: PWM调光; Supplier Part: C2829089; Manufacturer: 欧思科光电; Supplier Footprint: SMD-6P,5x5.5mm; JLCPCB Part Class: 扩展库; Datasheet: https://atta.szlcsc.com/upload/public/pdf/source/20210707/C2829089_00575F71B48730257B3D93D822BB4CA9.pdf; Supplier: LCSC; Channels: 2; Dimming: PWM; Operating temperature: -20℃~+80℃
U37 = TPS5430DDAR: 功能类型:降压型;输出类型:可调;工作电压:5.5V~36V;输出电压:1.221V~32.04V;输出电流:3A;; LCSC Part Name: 宽输入范围、3A输出电流的降压转换器; Supplier Part: C9864; Manufacturer: TI(德州仪器); Supplier Footprint: SOIC-8-EP; JLCPCB Part Class: 基础库; Datasheet: https://www.ti.com/cn/lit/gpn/tps5430; Supplier: LCSC; Function: 降压型; Output Type: 可调; Input Voltage: 5.5V~36V; Output Voltage: 1.221V~32.04V; Output Current: 3A; Switching Frequency: 500kHz; Operating Temperature: -40℃~+125℃@(TJ); Synchronous Rectification: 否; Number of Outputs: 1; Topology: 降压式; Switch tube (built-in/external): 内置
USB1 = MicroQTJ: 连接器类型:Micro-B;标准:USB 2.0;公母:母;端口数量:1;触点数量:5P;安装方式:卧贴;额定电流 - 电源:-;工作温度范围:-30℃~+80℃;; LCSC Part Name: Micro-B 母 卧贴; Supplier Part: C404968; Manufacturer: SHOU HAN(首韩); Supplier Footprint: SMD; JLCPCB Part Class: 扩展库; Datasheet: https://atta.szlcsc.com/upload/public/pdf/source/20191210/C404968_B20FD489995C34B84F95A25A4974802C.pdf; Supplier: LCSC; Connector Type: Micro-B; Standard: USB 2.0; Gender: 母; Number of Ports: 1; Number of Contacts: 5P; Mounting Style: 卧贴; Operating Temperature Range: -30℃~+80℃
C51 C53 C55 C57 = CL10A475KO8NNNC: 容值:4.7uF;精度:±10%;额定电压:16V;材质(温度系数):X5R;; LCSC Part Name: 4.7uF ±10% 16V; Supplier Part: C19666; Manufacturer: SAMSUNG(三星); Supplier Footprint: 0603; JLCPCB Part Class: 基础库; Datasheet: https://atta.szlcsc.com/upload/public/pdf/source/20160218/1457707763339.pdf; Supplier: LCSC; Tolerance: ±10%; Voltage Rated: 16V; Temperature Coefficient: X5R
C52 C54 C56 C58 = CGA0603X7R104K500JT: 容值:100nF;精度:±10%;额定电压:50V;材质(温度系数):X7R;; LCSC Part Name: 100nF ±10% 50V; Supplier Part: C6119867; Manufacturer: HRE(芯声); Supplier Footprint: 0603; JLCPCB Part Class: 扩展库; Supplier: LCSC; Tolerance: ±10%; Voltage Rated: 50V; Temperature Coefficient: X7R
CN6-CN9 = L200HY-W-4A: 插针结构:1x4P;间距:2mm;安装方式:弯插;总PIN数:4P;排数:1;每排PIN数:4;; LCSC Part Name: 2mm 1x4P 带扣 弯插; Supplier Part: C7465578; Manufacturer: DEALON(德艺隆); Supplier Footprint: 弯插,P=2.0mm; JLCPCB Part Class: Extended Part; Datasheet: https://atta.szlcsc.com/upload/public/pdf/source/20230721/79F891903E78A2F121F1E102C0FAFF07.pdf; Supplier: LCSC; Pins Structure: 1x4P; Pitch: 2mm; Mounting Style: 弯插; Number of Pins: 4P; Number of Rows: 1; Number of PINs Per Row: 4
CN10-CN14 = HC-XHB-8AW: 插针结构:1x8P;间距:2.5mm;安装方式:弯插;参考系列:XHB;总PIN数:8P;排数:1;每排PIN数:8;行距:-;额定电流:3A;触头材质:黄铜;触头镀层:锡;工作温度范围:-25℃~+85℃;; LCSC Part Name: 1x8P 间距:2.5mm 弯插 系列:XHB; Supplier Part: C2845511; Manufacturer: HCTL(华灿天禄); Supplier Footprint: 弯插,P=2.5mm; JLCPCB Part Class: Extended Part; Datasheet: https://atta.szlcsc.com/upload/public/pdf/source/20230711/E76CB2F3936D97053488B02AAFAB274A.pdf; Supplier: LCSC; Pins Structure: 1x8P; Pitch: 2.5mm; Mounting Style: 弯插; Reference Series: XHB; Number of Pins: 8P; Number of Rows: 1; Number of PINs Per Row: 8; Current Rating (Max): 3A; Contact Material: 黄铜; Contact Plating: 锡; Operating Temperature Range: -25℃~+85℃; Rated Voltage (Max): 250V; Plastic Material: PA66; Flame Retardant Rating: UL94V-0; Colour: 白色; Z-Height of the Board: 6.35mm; X-Length of Bottom Edge on Board (Spacing Line): 22.5mm; Y-Width of Bottom Edge on Board: 7.42mm
LED3 = LTST-C191KSKT: 发光颜色:黄色;正向电压(VF):2.1V;功率:75mW;正向电流:20mA;主波长:584.5nm~597nm;二极管配置:-;透镜颜色:无色透明透镜;色温:-;发光强度:104mcd;发光角度:130°;载带方式:-;工作温度:-55℃~+85℃;; LCSC Part Name: 黄灯; Supplier Part: C125100; Manufacturer: LITEON(光宝); Supplier Footprint: 0603; JLCPCB Part Class: 扩展库; Datasheet: https://atta.szlcsc.com/upload/public/pdf/source/20180129/C125100_15171877314981315871.pdf; Supplier: LCSC; Emitted Color: 黄色; Forward Voltage (VF): 2.1V; Power Dissipation: 75mW; Forward Current: 20mA; Dominant Wavelength: 584.5nm~597nm; Peak Wavelength: 588nm; Lens Color: 无色透明透镜; Luminous Intensity: 104mcd; Viewing Angle: 130°; Operating Temperature: -55℃~+85℃
P1-P5 = 2.54-1*8P母环保: 插孔结构:1x8P;间距:2.54mm;行距:-;安装类型:直插;排数:单排;总孔位数:8P;塑高:-;触头材质:-;触头镀层:-;; LCSC Part Name: 间距:2.54mm 1x8P 直插; Supplier Part: C27438; Manufacturer: BOOMELE(博穆精密); Supplier Footprint: 插件,P=2.54mm; JLCPCB Part Class: 扩展库; Datasheet: https://atta.szlcsc.com/upload/public/pdf/source/20231221/1CA800C6799ED97958773716FAA1BFFE.pdf; Supplier: LCSC; Holes Structure: 1x8P; Pitch: 2.54mm; Mounting Type: 直插; Number of Rows: 单排; Number of Holes: 8P
Q2 = CJ2302: 数量:1个N沟道;漏源电压(Vdss):20V;连续漏极电流(Id):2.1A;导通电阻(RDS(on)):115mΩ@2.5V;耗散功率(Pd):400mW;阈值电压(Vgs(th)):1.2V@250uA;; LCSC Part Name: 1个N沟道 耐压:20V 电流:2.1A; Supplier Part: C2910175; Manufacturer: CJ(江苏长电/长晶); Supplier Footprint: SOT-23; JLCPCB Part Class: Extended Part; Datasheet: https://item.szlcsc.com/datasheet/CJ2302/3189194.html; Supplier: LCSC; Number: 1个N沟道; Drain to Source Voltage: 20V; Current - Continuous Drain(Id): 2.1A; RDS(on): 115mΩ@2.5V; Pd - Power Dissipation: 400mW; Gate Threshold Voltage (Vgs(th)): 1.2V@250uA; Gate Charge(Qg): 10nC@4.5V; Input Capacitance(Ciss): 300pF; Reverse Transfer Capacitance (Crss@Vds): 80pF; Operating Temperature: -55℃~+150℃@(Tj); Type: N沟道; Output Capacitance(Coss): 120pF
R14 = 0603WAF100JT5E: 电阻类型:厚膜电阻;阻值:10Ω;精度:±1%;功率:100mW;最大工作电压:75V;温度系数:±400ppm/℃;; LCSC Part Name: 10Ω ±1% 100mW 厚膜电阻; Supplier Part: C22859; Manufacturer: UNI-ROYAL(厚声); Supplier Footprint: 0603; JLCPCB Part Class: Basic Part; Datasheet: https://atta.szlcsc.com/upload/public/pdf/source/20200306/C422600_1E6D84923E4A46A82E41ADD87F860B5C.pdf; Supplier: LCSC; Type: 厚膜电阻; Tolerance: ±1%; Power(Watts): 100mW; Overload Voltage (Max): 75V; Temperature Coefficient: ±400ppm/℃; Operating Temperature Range: -55℃~+155℃
R46-R53 = 0603WAF3300T5E: 电阻类型:厚膜电阻;阻值:330Ω;精度:±1%;功率:100mW;最大工作电压:75V;温度系数:±100ppm/℃;; LCSC Part Name: 330Ω ±1% 100mW 厚膜电阻; Supplier Part: C23138; Manufacturer: UNI-ROYAL(厚声); Supplier Footprint: 0603; JLCPCB Part Class: 基础库; Datasheet: https://atta.szlcsc.com/upload/public/pdf/source/20200306/C422600_1E6D84923E4A46A82E41ADD87F860B5C.pdf; Supplier: LCSC; Type: 厚膜电阻; Tolerance: ±1%; Power(Watts): 100mW; Overload Voltage (Max): 75V; Temperature Coefficient: ±100ppm/℃; Operating Temperature Range: -55℃~+155℃
U6 = SN74LVC1G17DBVR: 输入类型:施密特触发器;电源电压:1.65V~5.5V;元件数:1;每个元件位数:1;灌电流(IOL):32mA;拉电流(IOH):32mA;; Supplier Part: C7836; Manufacturer: TI(德州仪器); Supplier Footprint: SOT-23-5; JLCPCB Part Class: 扩展库; Datasheet: https://www.ti.com/cn/lit/gpn/sn74lvc1g17; Supplier: LCSC; Input type: 施密特触发器; output type: 推挽; Supply Voltage: 1.65V~5.5V; Number of Elements: 1; Number of Bits per Element: 1; Sink Current: 32mA; Source Current: 32mA; Logic Family: 74LVC; Operating Temperature: -40℃~+125℃
U23-U26 = SN74LVC2G17DBVR: 输入类型:施密特触发器;工作电压:1.65V~5.5V;元件数:2;每个元件位数:1;灌电流(IOL):32mA;拉电流(IOH):32mA;; Supplier Part: C10429; Manufacturer: TI(德州仪器); Supplier Footprint: SOT-23-6; JLCPCB Part Class: 扩展库; Datasheet: https://www.ti.com/cn/lit/gpn/sn74lvc2g17; Supplier: LCSC; Input type: 施密特触发器; Voltage - Supply: 1.65V~5.5V; Number of Elements: 2; Number of Bits per Element: 1; Current - Output Low(IOL): 32mA; Current - Output High(IOH): 32mA; Logic Family: 74LVC; Operating Temperature: -40℃~+85℃
U27-U31 = PM254-1-09-Z-8.5: 插孔结构:1x9P;间距:2.54mm;行距:-;圆孔/方孔:方孔;安装类型:直插;排数:单排;总孔位数:9P;额定电流:3A;额定电压:-;插孔方向:顶部;塑高:8.5mm;触头材质:铜合金;工作温度范围:-40℃~+105℃;焊接温度(最大值):260℃@5S;; LCSC Part Name: 1x9P 间距:2.54mm 直插; Supplier Part: C2897372; Manufacturer: HCTL(华灿天禄); Supplier Footprint: 插件,P=2.54mm; JLCPCB Part Class: 扩展库; Datasheet: https://atta.szlcsc.com/upload/public/pdf/source/20230609/534BE42964C679BDE98E061007C4ABD6.pdf; Supplier: LCSC; Holes Structure: 1x9P; Pitch: 2.54mm; Circular Hole / Square Hole: 方孔; Mounting Type: 直插; Number of Rows: 单排; Number of Holes: 9P; Current Rating (Max): 3A; Holes Direction: 顶部; Insulation Height: 8.5mm; Contact Material: 铜合金; Operating Temperature Range: -40℃~+105℃; Soldering Temperature(Max): 260℃@5S
U32 = ZX-XH2.54-6PZZ: 插针结构:1x6P;间距:2.5mm;安装方式:直插;参考系列:XH;总PIN数:6P;排数:1;每排PIN数:6;行距:-;额定电流:3A;触头材质:黄铜;触头镀层:锡;工作温度范围:-25℃~+85℃;; LCSC Part Name: 1x6P 间距:2.5mm 直插 系列:XH; Supplier Part: C7429636; Manufacturer: Megastar(兆星); Supplier Footprint: 插件,P=2.5mm; JLCPCB Part Class: 扩展库; Datasheet: https://atta.szlcsc.com/upload/public/pdf/source/20230619/1243AD0A516E39CD3D274D8985780568.pdf; Supplier: LCSC; Pins Structure: 1x6P; Pitch: 2.5mm; Mounting Type: 直插; Reference Series: XH; Number of Pins: 6P; Number of Rows: 1; Number of PINs Per Row: 6; Rated Current: 3A; Contact Material: 黄铜; Contact Plating: 锡; Operating Temperature: -25℃~+85℃; Rated Voltage (Max): 250V; Plastic Material: PA66; Flame Retardant Rating: UL94V-0; Color: 白色; Z-Height of the Board: 7mm; X-Length of Bottom Edge on Board (Spacing Line): 17.5mm; Y-Width of Bottom Edge on Board: 5.9mm
U33 U34 = BX-MX1.25-3PWZ: 插针结构:1x3P;间距:1.25mm;安装方式:弯插;参考系列:PicoBlade(MX 1.25);总PIN数:3P;排数:1;每排PIN数:3;行距:-;额定电流:1A;触头材质:黄铜;触头镀层:锡;工作温度:-25℃~+85℃;; LCSC Part Name: 1x3P 间距:1.25mm 弯插 系列:PicoBlade(MX 1.25); Supplier Part: C18077928; Manufacturer: Bossie(博锡); Supplier Footprint: 弯插,P=1.25mm; JLCPCB Part Class: 扩展库; Datasheet: https://atta.szlcsc.com/upload/public/pdf/source/20231017/BD7559DF3E11F8C4B6ED603A7C2DEC33.pdf; Supplier: LCSC; Pins Structure: 1x3P; Pitch: 1.25mm; Mounting Type: 弯插; Reference Series: PicoBlade(MX 1.25); Number of Pins: 3P; Number of Rows: 1; Number of PINs Per Row: 3; Current Rating: 1A; Contact Material: 黄铜; Contact Plating: 锡; Operating Temperature: -25℃~+85℃; Voltage Rating: 125V; Plastic Material: PA; Color: 白色; Z-Height of the Board: 3.3mm; X-Length of Bottom Edge on Board (Spacing Line): 5.65mm; Y-Width of Bottom Edge on Board: 4.6mm

## Nets
3V3: C3.2 C4.2 C5.2 C6.2 C8.2 C11.2 C13.2 C15.2 C17.2 C19.2 C22.2 C23.2 C25.2 C26.1 C27.1 C32.1 C35.2 C38.2 C52.2 C54.2 C56.2 C58.2 D1.2 L1.1 R1.1 R3.2 R6.1 R24.2 R25.2 R27.2 R30.2 SW1.1(PIN1) SW1.2(PIN2) SW1.3(PIN3) SW1.4(PIN4) SW2.1(PIN1) SW2.2(PIN2) SW2.3(PIN3) SW2.4(PIN4) SW3.1(PIN1) SW3.2(PIN2) SW3.3(PIN3) SW3.4(PIN4) U1.16(VCC) U3.16(VCC) U4.2(VOUT) U4.4(VOUT) U6.5(VCC) U7.1(VCC) U10.5(VCC+) U12.5(VCC) U13.6(VBAT) U13.11(VDD) U13.19(VDD) U13.28(VDD) U13.50(VDD) U13.75(VDD) U13.100(VDD) U16.5(VCC) U23.5(VCC) U24.5(VCC) U25.5(VCC) U26.5(VCC) U27.4 U28.4 U29.4 U30.4 U31.4 U32.1 U38.2(VCC)
5V_IN: D5.2 USB1.1(VBUS)
+5V: BUZZER1.1(+) C30.1 C31.2 C51.1 C53.1 C55.1 C57.1 CN6.3 CN7.3 CN8.3 CN9.3 CN10.8 CN11.8 CN12.8 CN13.8 CN14.8 D2.2 D5.1 D7.2 D8.2 D9.2 D10.2 D11.2 D12.2 D13.2 D14.2 L3.2 P1.8 P2.8 P3.8 P4.8 P5.8 Q3.3(D) R10.1 R14.1 R15.2 R16.2 R42.1 R58.2 U4.3(VIN) U27.5 U28.5 U29.5 U30.5 U31.5
+16V: C68.1 C69.2 C70.2 D18.1(C) H1.1 H1.3 H1.5 H1.7 R9.2 U27.6 U27.7 U28.6 U28.7 U29.6 U29.7 U30.6 U30.7 U31.6 U31.7 U37.7(VIN)
GND: C1.1 C2.1 C3.1 C4.1 C5.1 C6.1 C7.1 C8.1 C9.1 C10.1 C11.1 C12.1 C13.1 C14.1 C15.1 C16.1 C17.1 C18.2 C19.1 C22.1 C23.1 C24.2 C25.1 C26.2 C27.2 C28.1 C29.1 C30.2 C31.1 C32.2 C35.1 C37.2 C38.1 C39.1 C40.1 C41.1 C51.2 C52.1 C53.2 C54.1 C55.2 C56.1 C57.2 C58.1 C68.2 C69.1 C70.1 CN6.1 CN7.1 CN8.1 CN9.1 CN10.4 CN11.4 CN12.4 CN13.4 CN14.4 D1.1 D2.1 D3.2(A) D7.1 D8.1 D9.1 D10.1 D11.1 D12.1 D13.1 D14.1 D17.2(A) D18.2(A) H1.2 H1.4 H1.6 H1.8 H2.3 LED1.1(-) LED2.2(A) LED3.1(-) P1.4 P2.4 P3.4 P4.4 P5.4 Q2.3(D) R4.2 R11.1 R12.1 R19.1 R31.1 R54.1 R57.2 RN2.5 RN2.6 RN2.7 RN2.8 RN4.5 RN4.6 RN4.7 RN4.8 RN6.5 RN6.6 RN6.7 RN6.8 U1.8(GND) U1.15(CLKINH) U3.3(E) U3.4(F) U3.5(G) U3.6(H) U3.8(GND) U3.10(SER) U3.14(D) U3.15(CLKINH) U4.1(GND) U6.3(GND) U7.8(GND) U8.2(E) U9.2(CAT) U9.3(EM) U10.2(VCC-) U11.2(CAT) U11.3(EM) U12.3(GND) U13.10(VSS) U13.20(VSSA) U13.27(VSS) U13.74(VSS) U13.99(VSS) U16.3(GND) U19.3(GND) U23.2(GND) U24.2(GND) U25.2(GND) U26.2(GND) U27.8 U27.9 U28.8 U28.9 U29.8 U29.9 U30.8 U30.9 U31.8 U31.9 U32.6 U34.2 U37.6(GND) U37.9(PowerPAD) U38.1(GND) USB1.5(GND) USB1.7(SH2) USB1.8(SH3)
VDDA: C1.2 C2.2 L1.2 R2.2 U13.22(VDDA)
ADC_BAT: C41.2 R9.1 R12.2 U13.36(PB1)
ADC_CAP: C40.2 D1.3 R18.1 R28.1 U13.35(PB0)
BOOT0: RN5.4 U13.94(BOOT0)
BUZZER: R8.1 U13.16(PC1)
CAP_VIN: H2.1 R18.2
CE: U7.2(CE) U13.83(PD2)
CHG_EN: H2.5 U13.33(PC4)
CHIP: R23.1 U13.26(PA3)
CHIP_OUT: H2.2 U9.4(COL)
CSN: U7.3(CSN) U13.82(PD1)
ENCODER_A1: U13.23(PA0-WKUP(PA0)) U23.6(1Y)
ENCODER_A2: U13.77(PA15(JTDI)) U24.6(1Y)
ENCODER_A3: U13.92(PB6) U25.6(1Y)
ENCODER_A4: U13.31(PA6) U26.6(1Y)
ENCODER_B1: U13.24(PA1) U23.4(2Y)
ENCODER_B2: U13.89(PB3(JTDOTRACESWO)) U24.4(2Y)
ENCODER_B3: U13.93(PB7) U25.4(2Y)
ENCODER_B4: U13.32(PA7) U26.4(2Y)
FSYNC: U13.9(PC15-OSC32_OUT(PC15))
INT: U13.8(PC14-OSC32_IN(PC14))
IR_BALL_DECT: R20.2 U6.4(Y) U13.15(PC0)
IR_PWM: R17.1 U13.95(PB8)
IRQ: R6.2 U7.7(IRQ) U13.81(PD0)
JATG_SWDCLK: R54.2 U13.76(PA14(JTCK-SWCLK)) U32.4
JATG_SWDIO: R1.2 U13.72(PA13(JTMS-SWDIO)) U32.5
LED_CLK: R41.1 U13.30(PA5)
LED_COMM: R13.1 U13.67(PA8)
LED_DAT: R40.1 U13.91(PB5)
LED_PWR: Q3.1(G) R42.2 U13.57(PD10)
MISO: U7.6(MISO) U13.79(PC11)
MOSI: U7.5(MOSI) U13.80(PC12)
MOTOR_BRK1: U13.3(PE4) U27.3
MOTOR_BRK2: U13.38(PE7) U28.3
MOTOR_BRK3: U13.5(PE6) U29.3
MOTOR_BRK4: U13.4(PE5) U30.3
MOTOR_BRK5: U13.39(PE8) U31.3
MOTOR_DIR1: U13.97(PE0) U27.1
MOTOR_DIR2: U13.2(PE3) U28.1
MOTOR_DIR3: U13.1(PE2) U29.1
MOTOR_DIR4: U13.98(PE1) U30.1
MOTOR_DIR5: U13.41(PE10) U31.1
MOTOR_PWM1: U13.40(PE9) U27.2
MOTOR_PWM2: U13.45(PE14) U28.2
MOTOR_PWM3: U13.44(PE13) U29.2
MOTOR_PWM4: U13.42(PE11) U30.2
MOTOR_PWM5: U13.96(PB9) U31.2
NRST: C18.1 R3.1 U13.14(NRST) U32.2
SCK: U7.4(SCK) U13.78(PC10)
SCL: U13.47(PB10) U38.3(SCL)
SDA: U13.48(PB11) U38.4(SDA)
SHOOT: R25.1 U12.2(B) U13.25(PA2)
SHOOT_2: R29.1 U12.4(Y)
SHOOT_OFF: R26.2 R27.1 U10.4(OUT) U13.7(PC13)
SHOOT_OUT: H2.4 U11.4(COL)
SW_CLK: U1.2(CLK) U3.2(CLK) U13.65(PC8)
SW_D: U1.9(QH) U13.66(PC9)
SW_LD: U1.1(SH/LD#) U3.1(SH/LD#) U13.64(PC7)
UD+: U16.1(UD+) USB1.3(D+)
UD-: U16.2(UD-) USB1.2(D-)
USART_RX: U13.69(PA10) U16.6(TXD)
USART_TX: U13.68(PA9) U16.7(RXD)
$1N4438: C7.2 C10.2 R2.1 U13.21(VREF+)
$1N4971: R8.2 R11.2 U8.1(B)
$1N5079: BUZZER1.2(-) U8.3(C)
$1N5182: C16.2 U13.13(PH1-OSC_OUT(PH1)) X1.1(OSC1)
$1N5208: C14.2 U13.12(PH0-OSC_IN(PH0)) X1.2(OSC2)
$1N14140: C12.2 U13.49(VCAP_1)
$1N14147: C9.2 U13.73(VCAP_2)
$1N22834: R4.1 U13.37(PB2-BOOT1(PB2))
$1N48575: LED2.1(K) R13.2
$1N48580: LED1.2(+) R10.2
$2N127: R23.2 U9.1(AN)
$2N711: R29.2 U11.1(AN)
$2N10692: C28.2 D3.1(K) R24.1 U12.1(A)
$2N13663: C29.2 R30.1 R31.2 U10.3(-IN)
$2N14038: R26.1 R28.2 U10.1(+IN)
$2N20737: C37.1 U16.8(V3)
$2N27734: RN3.5 RN4.4 SW2.8(PIN8)
$2N27735: RN1.2 RN2.3 SW1.7(PIN7)
$2N27736: RN1.4 RN2.1 SW1.5(PIN5)
$2N27737: RN1.1 RN2.4 SW1.8(PIN8)
$2N27739: RN1.8 U1.11(A)
$2N27740: RN1.3 RN2.2 SW1.6(PIN6)
$2N27741: RN3.4 U1.3(E)
$2N27742: RN3.3 U1.4(F)
$2N27743: RN3.2 U1.5(G)
$2N27744: RN5.2 U3.12(B)
$2N27748: RN1.5 U1.14(D)
$2N27749: RN1.6 U1.13(C)
$2N27750: RN1.7 U1.12(B)
$2N27755: U1.10(SER) U3.9(QH)
$2N27763: RN3.8 RN4.1 SW2.5(PIN5)
$2N27764: RN3.7 RN4.2 SW2.6(PIN6)
$2N27765: RN3.6 RN4.3 SW2.7(PIN7)
$2N27769: RN3.1 U1.6(H)
$2N27770: RN5.1 U3.13(C)
$2N27775: RN5.6 RN6.3 SW3.7(PIN7)
$2N27779: RN5.5 RN6.4 SW3.8(PIN8)
$2N27783: RN5.8 RN6.1 SW3.5(PIN5)
$2N27787: RN5.7 RN6.2 SW3.6(PIN6)
$2N27794: RN5.3 U3.11(A)
$2N28091: C39.2 Q3.2(S) R38.2 R39.2 U19.4(VCC)
$2N28095: R39.1 R41.2 U19.2(CKI)
$2N28096: R38.1 R40.2 U19.1(SDI)
$2N33694: C67.2 D17.1(K) L3.1 U37.8(PH)
$2N33704: R57.1 R58.1 U37.4(VSENSE)
$2N33708: C67.1 U37.1(BOOT)
$3N2149: R14.2 U33.1
$3N2150: Q2.2(S) U33.2
$3N2153: Q2.1(G) R17.2 R19.2
$3N2156: D2.3 R15.1 R21.1 U6.2(A)
$3N2158: C24.1 R16.1 U34.3
$3N2160: LED3.2(+) R20.1
$3N2176: R21.2 U34.1
$3N2966: CN6.2 R46.2
$3N2970: CN6.4 R47.2
$3N3098: D7.3 R46.1 U23.1(1A)
$3N3102: D8.3 R47.1 U23.3(2A)
$3N3909: D9.3 R48.1 U24.1(1A)
$3N3912: D10.3 R49.1 U24.3(2A)
$3N3948: CN7.2 R48.2
$3N3950: CN7.4 R49.2
$3N4791: D13.3 R52.1 U26.1(1A)
$3N4794: D14.3 R53.1 U26.3(2A)
$3N4814: D12.3 R51.1 U25.3(2A)
$3N4818: D11.3 R50.1 U25.1(1A)
$3N4824: CN8.2 R50.2
$3N4826: CN8.4 R51.2
$3N4848: CN9.2 R52.2
$3N4850: CN9.4 R53.2
$3N5979: CN10.1 P1.1
$3N5983: CN10.2 P1.2
$3N5988: CN10.3 P1.3
$3N5998: CN10.5 P1.5
$3N6003: CN10.6 P1.6
$3N6008: CN10.7 P1.7
$3N6141: CN11.7 P2.7
$3N6145: CN11.6 P2.6
$3N6147: CN11.5 P2.5
$3N6149: CN11.3 P2.3
$3N6153: CN11.1 P2.1
$3N6155: CN11.2 P2.2
$3N6282: CN12.7 P3.7
$3N6286: CN12.6 P3.6
$3N6288: CN12.5 P3.5
$3N6290: CN12.3 P3.3
$3N6294: CN12.1 P3.1
$3N6296: CN12.2 P3.2
$3N6423: CN13.7 P4.7
$3N6427: CN13.6 P4.6
$3N6429: CN13.5 P4.5
$3N6431: CN13.3 P4.3
$3N6435: CN13.1 P4.1
$3N6437: CN13.2 P4.2
$3N6564: CN14.7 P5.7
$3N6568: CN14.6 P5.6
$3N6570: CN14.5 P5.5
$3N6572: CN14.3 P5.3
$3N6576: CN14.1 P5.1
$3N6578: CN14.2 P5.2

Not connected (* = marked no-connect by the designer): H2 6*; U1 7(Q#H)*; U3 7(Q#H)*; U6 1(N.C)*; U7 9 10; U13 17(PC2)* 18(PC3)* 29(PA4)* 34(PC5)* 43(PE12)* 46(PE15)* 51(PB12)* 52(PB13)* 53(PB14)* 54(PB15)* 55(PD8)* 56(PD9)* 58(PD11)* 59(PD12)* 60(PD13)* 61(PD14)* 62(PD15)* 63(PC6)* 70(PA11)* 71(PA12)* 84(PD3)* 85(PD4)* 86(PD5)* 87(PD6)* 88(PD7)* 90(PB4(NJTRST))*; U16 4(RTS#)*; U19 5(CKO)* 6(SDO)*; U32 3*; U33 3; U37 2(NC)* 3(NC)* 5(ENA)*; USB1 4(ID)* 6(SH1)* 9(SH4)*

## Notes on the sheets
sheet 1
- STM32最小系统
- 无线射频通信
- 功率板接口
- OLED显示屏
- 蜂鸣器
- 电池电压采样
- LED
sheet 2
- 踢球挑球信号
- 电容正常升压判断
- 拨码开关
- 串口调试模块
- 彩色LED
- 16转5V再转3V3
sheet 3
- JTAG接口
- 红外发射端
- 编码器接口
- 红外接收端
- 电机驱动接口
